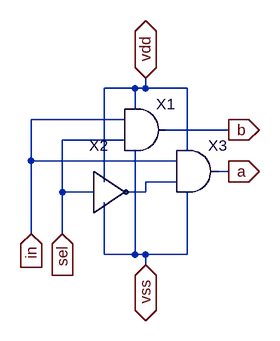
[diagram p0: schematic dmux.asc]
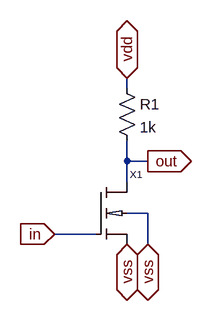
[diagram p1: sub-circuit not.asc]
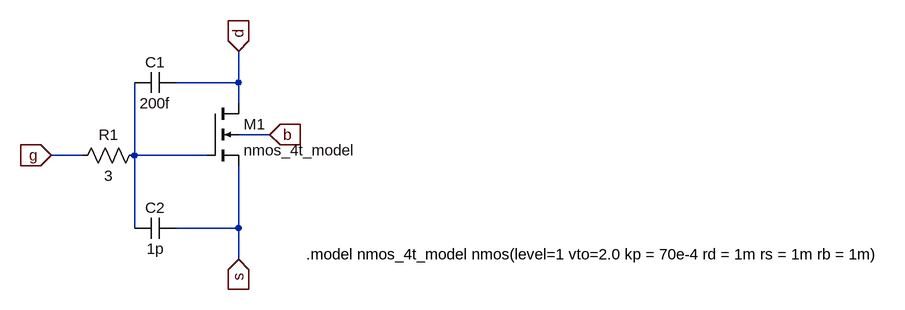
[diagram p2: sub-circuit nmos_4t.asc]
dmux.asc, the LTspice schematic file:
Version 4
SHEET 1 880 680
WIRE 272 -16 224 -16
WIRE 288 -16 288 -32
WIRE 288 -16 272 -16
WIRE 352 -16 288 -16
WIRE 272 16 272 -16
WIRE 256 32 112 32
WIRE 416 48 320 48
WIRE 256 64 160 64
WIRE 352 80 352 -16
WIRE 112 96 112 32
WIRE 336 96 112 96
WIRE 416 112 400 112
WIRE 224 128 224 -16
WIRE 336 128 288 128
WIRE 160 144 160 64
WIRE 208 144 160 144
WIRE 288 144 288 128
WIRE 288 144 256 144
WIRE 112 208 112 96
WIRE 160 208 160 144
WIRE 224 240 224 160
WIRE 272 240 272 80
WIRE 272 240 224 240
WIRE 288 240 272 240
WIRE 352 240 352 144
WIRE 352 240 288 240
WIRE 288 256 288 240
FLAG 160 208 sel
IOPIN 160 208 In
FLAG 112 208 in
IOPIN 112 208 In
FLAG 288 -32 vdd
IOPIN 288 -32 BiDir
FLAG 288 256 vss
IOPIN 288 256 BiDir
FLAG 416 48 b
IOPIN 416 48 Out
FLAG 416 112 a
IOPIN 416 112 Out
SYMBOL and 288 -16 R0
SYMATTR InstName X1
SYMBOL not 208 144 R0
SYMATTR InstName X2
SYMBOL and 368 48 R0
SYMATTR InstName X3

not.asc, the sub-circuit schematic file:
Version 4
SHEET 1 880 680
WIRE 176 -96 176 -112
WIRE 176 16 176 -16
WIRE 208 16 176 16
WIRE 176 48 176 16
WIRE 208 96 176 96
WIRE 128 128 64 128
WIRE 208 144 208 96
FLAG 64 128 in
IOPIN 64 128 In
FLAG 176 144 vss
IOPIN 176 144 BiDir
FLAG 176 -112 vdd
IOPIN 176 -112 BiDir
FLAG 208 16 out
IOPIN 208 16 Out
FLAG 208 144 vss
IOPIN 208 144 BiDir
SYMBOL res 160 -112 R0
SYMATTR InstName R1
SYMATTR Value 1k
SYMBOL nmos_4t 128 48 R0
SYMATTR InstName X1

nmos_4t.asc, the sub-circuit schematic file:
Version 4
SHEET 1 880 680
WIRE -288 -224 -288 -272
WIRE -288 -224 -384 -224
WIRE -288 -192 -288 -224
WIRE -240 -144 -288 -144
WIRE -528 -112 -576 -112
WIRE -448 -112 -448 -224
WIRE -336 -112 -448 -112
WIRE -448 0 -448 -112
WIRE -288 0 -288 -96
WIRE -288 0 -384 0
WIRE -288 48 -288 0
FLAG -576 -112 g
IOPIN -576 -112 In
FLAG -288 -272 d
IOPIN -288 -272 In
FLAG -288 48 s
IOPIN -288 48 In
FLAG -240 -144 b
IOPIN -240 -144 In
SYMBOL nmos4 -336 -192 R0
SYMATTR InstName M1
SYMATTR Value nmos_4t_model
SYMBOL cap -384 -240 R90
WINDOW 0 0 32 VBottom 2
WINDOW 3 32 32 VTop 2
SYMATTR InstName C1
SYMATTR Value 200f
SYMBOL cap -384 -16 R90
WINDOW 0 0 32 VBottom 2
WINDOW 3 32 32 VTop 2
SYMATTR InstName C2
SYMATTR Value 1p
SYMBOL res -432 -128 R90
WINDOW 0 0 56 VBottom 2
WINDOW 3 32 56 VTop 2
SYMATTR InstName R1
SYMATTR Value 3
TEXT -184 40 Left 2 !.model nmos_4t_model nmos(level=1 vto=2.0 kp = 70e-4 rd = 1m rs = 1m rb = 1m)

The netlist it stands for:
* dmux.asc
XX1 in sel vdd vss b and  ; pins a b vdd vss out
XX2 sel N001 vss vdd not
XX3 in N001 vdd vss a and  ; pins a b vdd vss out

* block symbol definitions
.subckt not in out vss vdd
R1 vdd out 1k
XX1 out in vss vss nmos_4t
.ends not

.subckt nmos_4t D G S B
M1 d N001 s b nmos_4t_model
C1 d N001 200f
C2 s N001 1p
R1 N001 g 3
.model nmos_4t_model nmos(level=1 vto=2.0 kp = 70e-4 rd = 1m rs = 1m rb = 1m)
.ends nmos_4t

.model NMOS NMOS
.model PMOS PMOS
.lib standard.mos
.backanno
.end